# EAGLE design bldc (EAGLE 9.5.0)
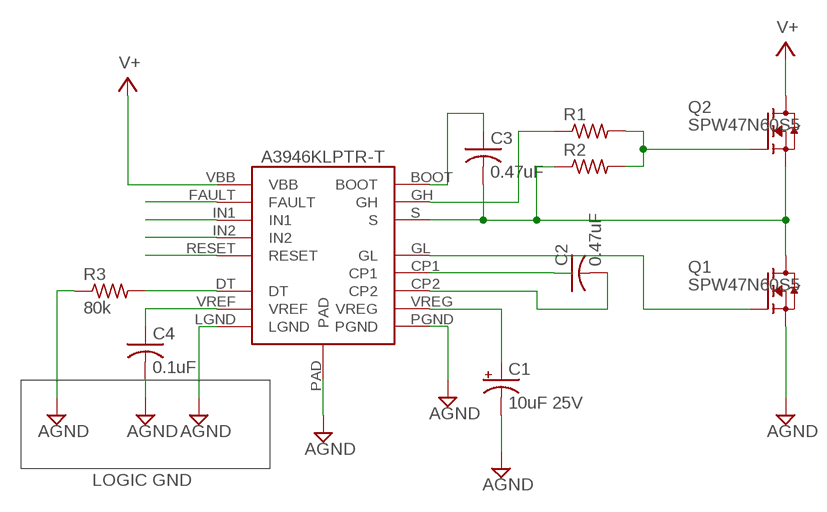
[diagram p0: schematic, sheet 1]

## Parts
C1  10uF 25V  CPOL-US175TMP-0808  [175TMP-0808]
C2  0.47uF  C-USC0805  [C0805]
C3  0.47uF  C-US050-030X075  [C050-030X075]
C4  0.1uF  C-USC0805  [C0805]
Q1  SPW47N60S5  [P-TO247]
Q2  SPW47N60S5  [P-TO247]
R1  R-US_R0805  [R0805]
R2  R-US_R0805  [R0805]
R3  80k  R-US_R0805  [R0805]
U$1  A3946KLPTR-T  [SOP65P640X120-17T300]

## Nets
AGND: C1.- C4.2 Q1.3(S) R3.1 U$1.LGND U$1.PAD U$1.PGND
N$1: C2.2 U$1.CP2
N$2: C1.+ U$1.VREG
N$3: C2.1 U$1.CP1
N$4: Q1.1(G) U$1.GL
N$5: C3.2 Q1.2(D) Q2.3(S) R2.1 U$1.S
N$6: C3.1 U$1.BOOT
N$7: R1.1 U$1.GH
N$8: Q2.1(G) R1.2 R2.2
N$9: C4.1 U$1.VREF
N$10: R3.2 U$1.DT
N$11: U$1.RESET
N$12: U$1.IN2
N$13: U$1.IN1
N$14: U$1.FAULT
V+: Q2.2(D) U$1.VBB

## Notes on the sheet
- LOGIC GND

## Library data of the parts
C1 = rcl:CPOL-US: POLARIZED CAPACITOR, American symbol; SPICEPREFIX: C
C2-C4 = rcl:C-US: CAPACITOR, American symbol; SPICEPREFIX: C
Q1 Q2 = transistor-fet:SPW47N60S5: Cool MOS Power Transistor
R1-R3 = rcl:R-US_: RESISTOR, American symbol; SPICEPREFIX: R
U$1 = MotorDriver:A3946KLPTR-T

## Board
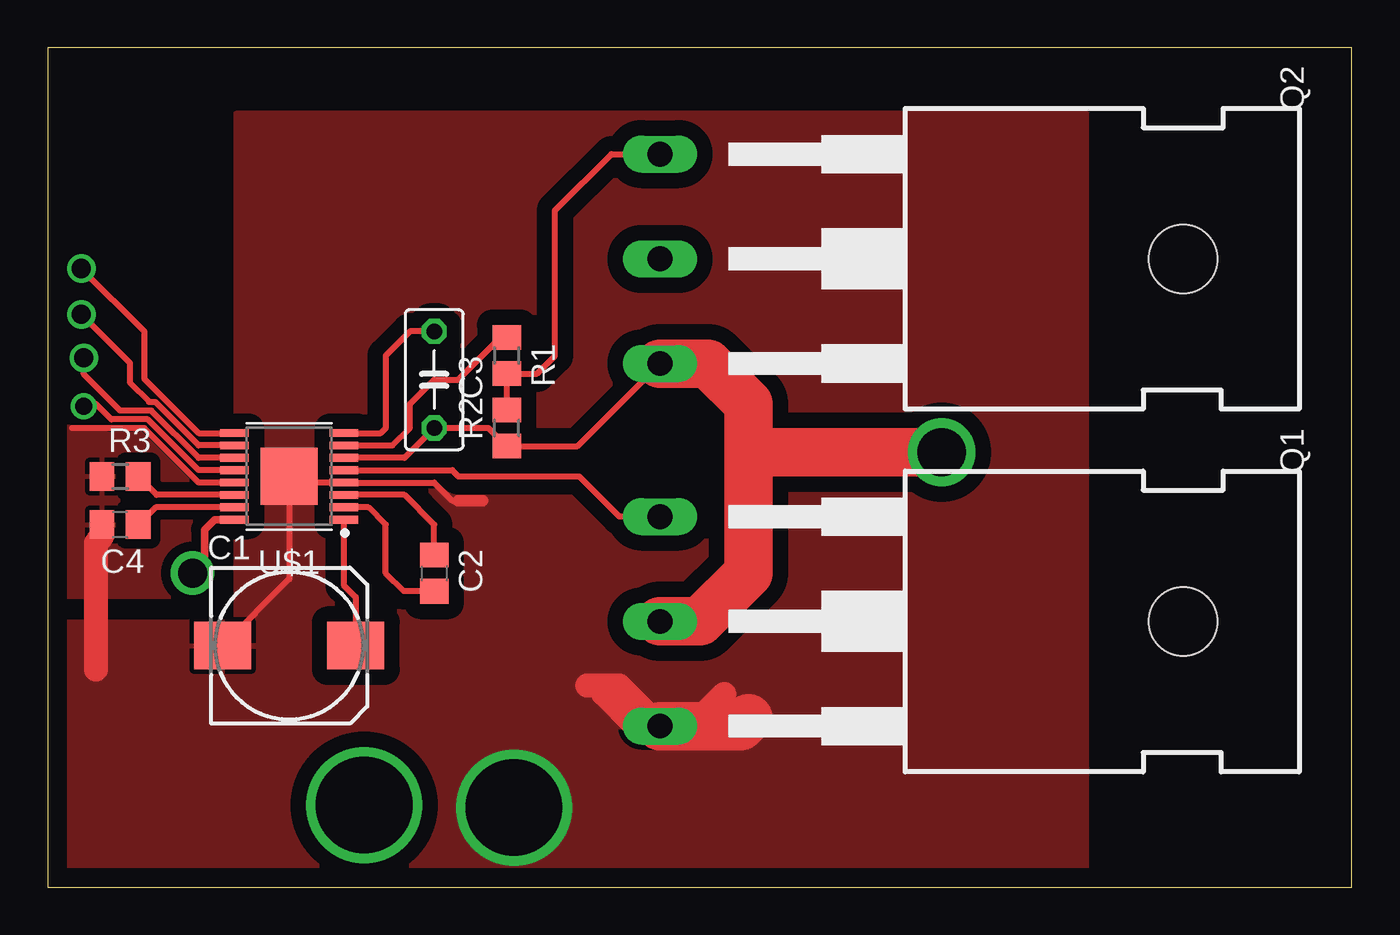
[diagram p1: board, top side]
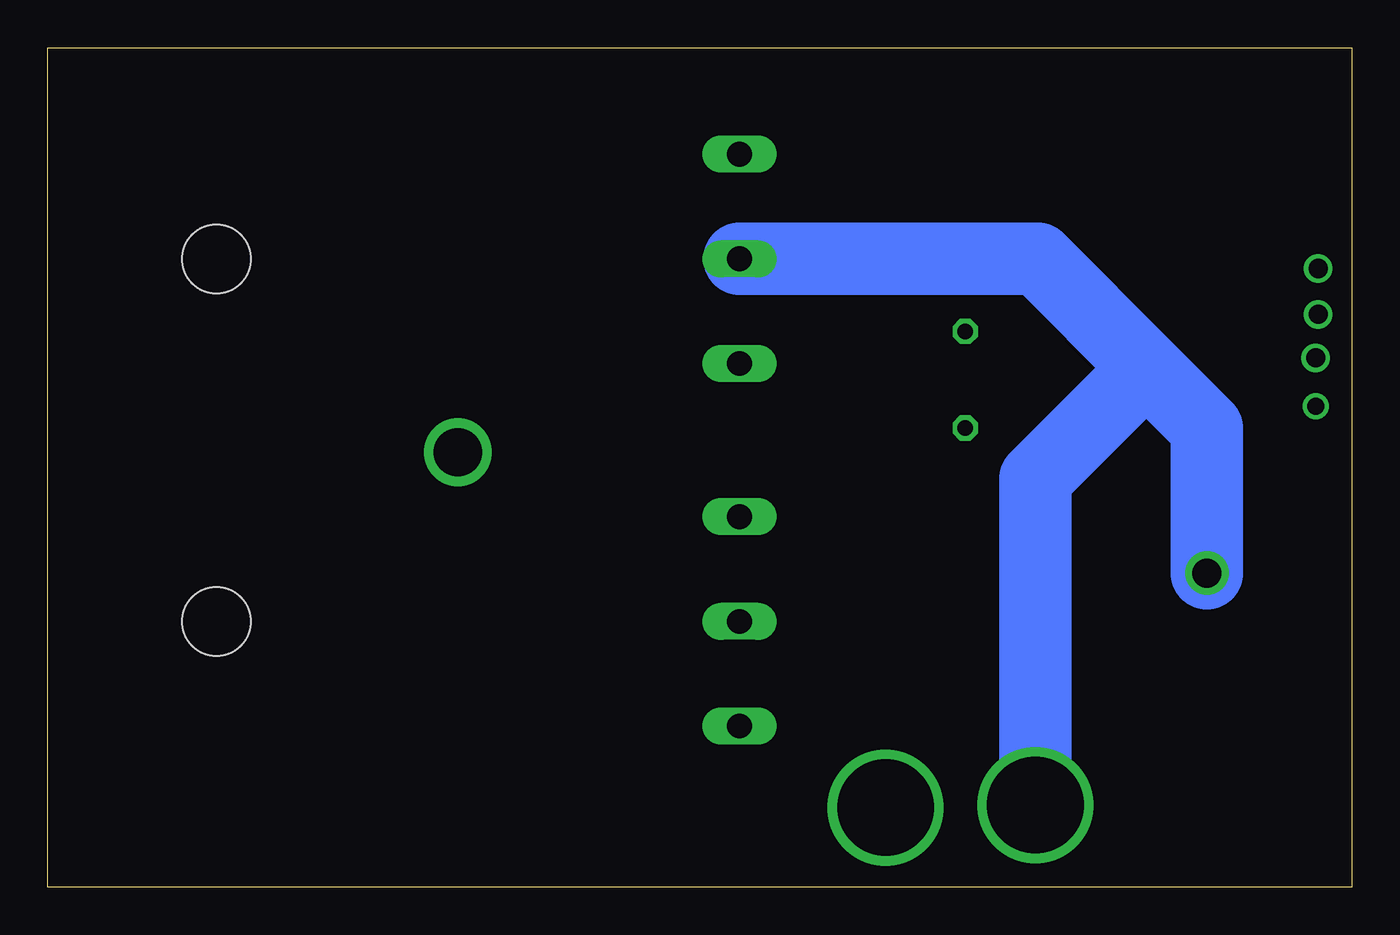
[diagram p2: board, bottom side, seen from below]

Size 68.56 x 44.12 mm. Coordinates in mm from the lower left corner, seen from the top.
Outline: 0,0 68.56,0 68.56,44.12 0,44.12 0,0
Copper layers (1*16): Top 0.035mm / dielectric 1.5mm / Bottom 0.035mm
Design rules "default": minimum track width 6mil, minimum drill 0.35mm, track to track 6mil, track to pad 6mil, pad to pad 6mil, via to via 6mil, smd to smd 6mil, copper to edge 40mil, drill to drill 6mil, minimum pad ring 10mil, minimum via ring 8mil, stop-mask expansion 4mil, vias tented up to drill 0mil, thermal gap 10mil

### Footprints (pad centres in the part's own frame; a part is rotated, then mirrored left to right if it is on the bottom)
175TMP-0808 = smd 3 x 2.5: + 3.5,0; - -3.5,0
C0805 = smd 1.3 x 1.5: 1 -0.95,0; 2 0.95,0
C050-030X075 = drill 0.813 octagon: 1 -2.54,0; 2 2.54,0
P-TO247 = drill 1.3 long: 1 -5.5,-27.5; 2 0,-27.5; 3 5.5,-27.5 | hole 3.6: 0,0
R0805 = smd 1.3 x 1.5: 1 -0.95,0; 2 0.95,0
SOP65P640X120-17T300 = smd 1.488 x 0.407: BOOT -2.87,-2.275; CP1 -2.87,0.975; CP2 -2.87,1.625; DT 2.87,0.975; FAULT 2.87,-2.275; GH -2.87,-1.625; GL -2.87,-0.325; IN1 2.87,-1.625; IN2 2.87,-0.975; LGND 2.87,0.325; PGND -2.87,0.325; RESET 2.87,-0.325; S -2.87,-0.975; VBB 2.87,2.275; VREF 2.87,1.625; VREG -2.87,2.275 | smd 3 x 3: PAD 0,0

### Placement (x,y rotation side)
C1  12.7,12.7 0 top
C2  20.32,16.51 270 top
C3  20.32,26.67 270 top
C4  3.81,19.05 180 top
Q1  59.69,13.97 270 top
Q2  59.69,33.02 270 top
R1  24.13,27.94 270 top
R2  24.13,24.13 90 top
R3  3.81,21.59 0 top
U$1  12.7,21.59 180 top

### Tracks (layer width: path | path; a pad name or v marks a point on that pad's centre or on a via)
AGND  (via drill 5.08)
  Top 0.305: C1.- 12.7,16.2 U$1.PAD 13.03,21.27 U$1.PGND 20.32,21.27 21.27,20.32 21.59,20.32 | U$1.LGND 7.95,21.27 5.08,24.13 1.27,24.13
  Top 0.61: 21.59,20.32 22.86,20.32
  Top 1.27: Q1.3 33.87,8.47 35.56,10.16 | Q1.3 30.9,8.47 29.21,10.16 | Q1.3 30.06,10.6 28.38,10.6 | C4.2 2.86,18.42 2.54,18.1 2.54,11.43
  Top 2.54: Q1.3 36.41,8.47 36.83,8.89
  other vias: 24.51,4.19
  pour Top (isolate 0.813): 9.91,40.64 9.91,0 54.61,0 54.61,40.64
  pour Top: 11.43,0 0,0 0,13.97 11.43,13.97
  pour Top (isolate 0.508): 0,40.64 8.89,40.64 8.89,15.24 0,15.24
N$1
  Top 0.305: C2.2 18.73,15.56 17.78,16.51 17.78,19.05 16.86,19.96 U$1.CP2
N$2
  Top 0.305: C1.+ 16.2,15.24 15.57,15.87 U$1.VREG
N$3
  Top 0.305: C2.1 20.32,19.05 18.75,20.61 U$1.CP1
N$4
  Top 0.305: Q1.1 30.06,19.47 27.94,21.59 21.59,21.59 21.27,21.91 U$1.GL
N$5  (via drill 2.54)
  Top 0.305: U$1.S 18.75,22.57 C3.2 23.18,24.13 R2.1 27.85,23.18 Q2.3
  Top 1.27: 36.83,24.13 36.83,22.86 36.83,16.51
  Top 2.54: Q1.2 34.29,13.97 36.83,16.51 36.83,24.13 36.83,25.4 34.71,27.52 Q2.3 | v46.99,22.86 36.83,22.86
N$6
  Top 0.305: U$1.BOOT 17.52,23.86 17.78,24.13 17.78,27.94 19.05,29.21 C3.1
N$7
  Top 0.305: U$1.GH 18.14,23.21 19.05,24.13 19.05,25.4 20.32,26.67 21.59,26.67 23.81,28.89 R1.1
N$8
  Top 0.305: R2.2 R1.2 25.72,26.99 26.67,27.94 26.67,35.56 29.63,38.52 Q2.1
N$9
  Top 0.305: U$1.VREF 5.67,19.96 C4.1
N$10
  Top 0.305: U$1.DT 5.74,20.61 R3.2
N$11  (via drill 0.9)
  Top 0.305: U$1.RESET 7.94,21.91 5.27,24.59 3.35,24.59 2.54,25.4 2.03,25.4 v1.91,25.27
N$12  (via drill 1)
  Top 0.305: U$1.IN2 7.94,22.57 5.46,25.04 3.81,25.04 1.9,26.95 v1.9,27.81
N$13  (via drill 1)
  Top 0.305: U$1.IN1 7.93,23.21 5.65,25.5 5.33,25.5 4.32,26.52 4.32,27.56 v1.78,30.1
N$14  (via drill 1)
  Top 0.305: U$1.FAULT 7.93,23.86 5.08,26.72 5.08,29.21 v1.78,32.51
V+  (via drill 1.52, 5.08)
  Top 0.406: U$1.VBB 8.77,19.32 8.26,18.8 8.26,17.14 v7.62,16.51
  Bottom 3.81: Q2.2 16.51,33.02 10.79,27.3 | 10.79,27.3 7.62,24.13 v7.62,16.51 | 10.79,27.3 16.64,21.46 v16.64,4.32